# EAGLE design ovtave up pcbv1.5 (EAGLE 9.5.2)
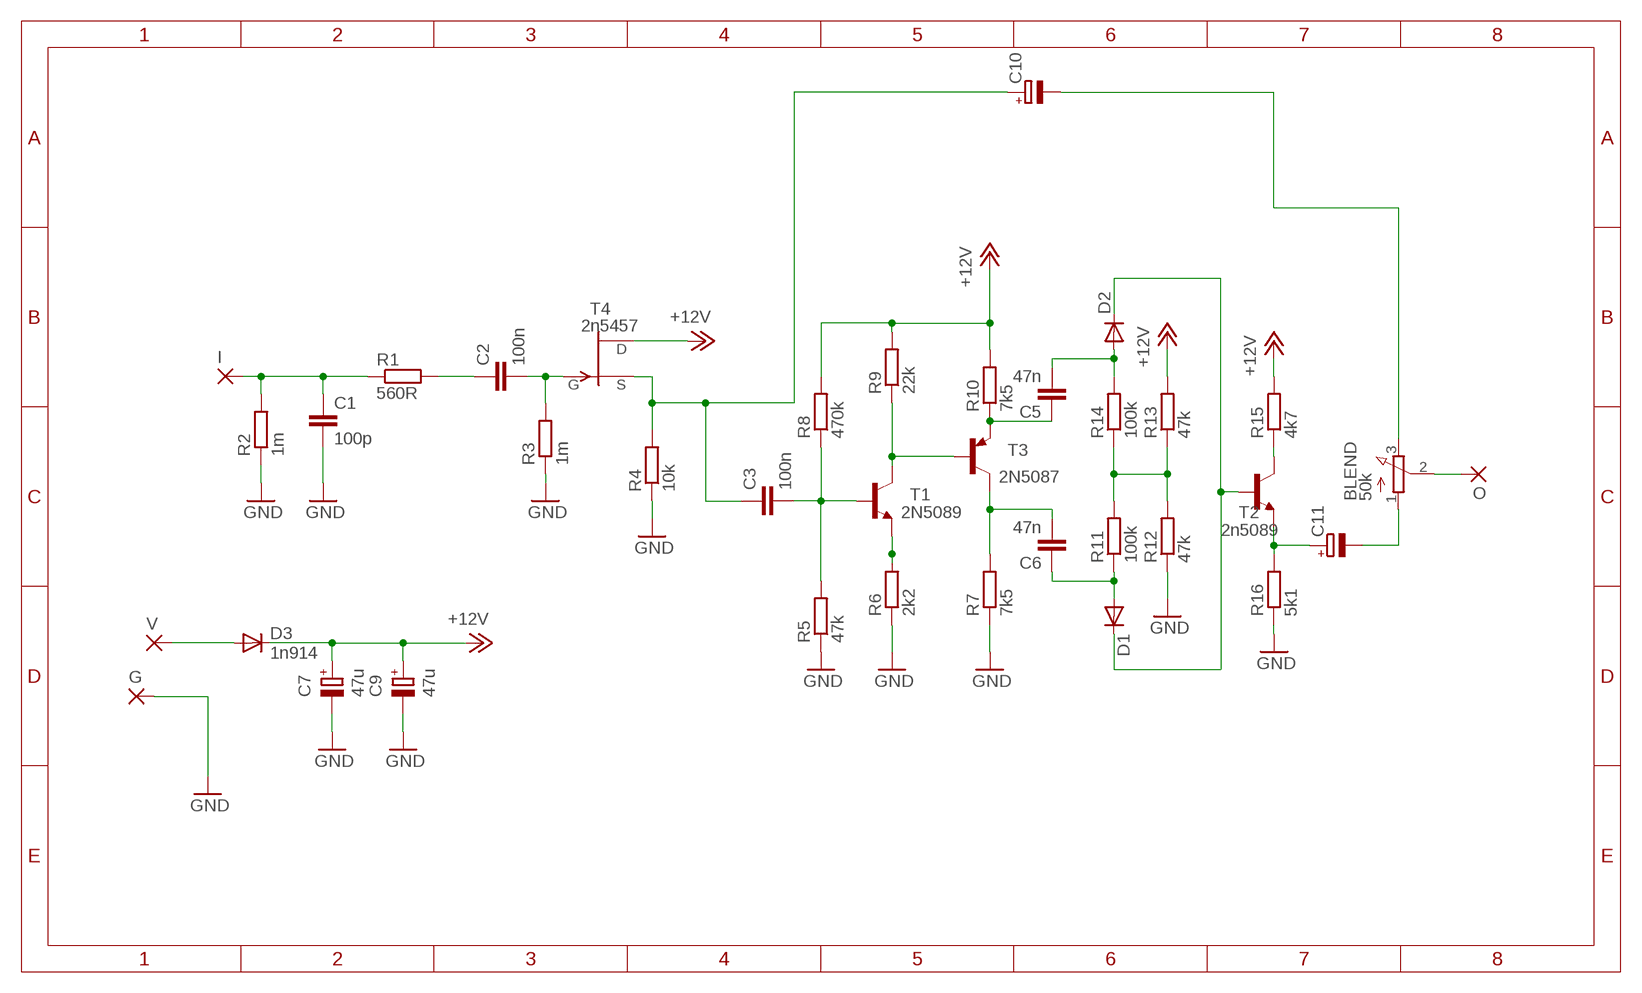
[diagram p0: schematic, sheet 1]

## Parts
BLEND  50k  HEXPOT1  [3RP/1610N]
C1  100p  C5/2.5  [C5B2.5]
C2  100n  C5/2.5  [C5B2.5]
C3  100n  C5/2.5  [C5B2.5]
C5  47n  C5/2.5  [C5B2.5]
C6  47n  C5/2.5  [C5B2.5]
C7  47u  CPOL-EUE2-4  [E2-4]
C9  47u  CPOL-EUE2-4  [E2-4]
C10  CPOL-EUE2-4  [E2-4]
C11  CPOL-EUE2-4  [E2-4]
D1  Ge fV match  SMALL_DIODEDO35-7  [DO35-7]
D2  Ge fV match  SMALL_DIODEDO35-7  [DO35-7]
D3  1n914  SMALL_DIODEDO35-7  [DO35-7]
G  1,6/0,9  [1,6/0,9]
I  1,6/0,9  [1,6/0,9]
O  1,6/0,9  [1,6/0,9]
R1  560R  R-EU_0207/7  [0207/7]
R2  1m  R-EU_0207/7  [0207/7]
R3  1m  R-EU_0207/7  [0207/7]
R4  10k  R-EU_0207/7  [0207/7]
R5  47k  R-EU_0207/7  [0207/7]
R6  2k2  R-EU_0207/7  [0207/7]
R7  7k5  R-EU_0207/7  [0207/7]
R8  470k  R-EU_0207/7  [0207/7]
R9  22k  R-EU_0207/7  [0207/7]
R10  7k5  R-EU_0207/7  [0207/7]
R11  100k  R-EU_0207/7  [0207/7]
R12  47k  R-EU_0207/7  [0207/7]
R13  47k  R-EU_0207/7  [0207/7]
R14  100k  R-EU_0207/7  [0207/7]
R15  4k7  R-EU_0207/7  [0207/7]
R16  5k1  R-EU_0207/7  [0207/7]
T1  2N5089  [TO92]
T2  2n5089  2N5089  [TO92]
T3  2N5087  [TO92]
T4  2n5457  J201  [TO92]
V  1,6/0,9  [1,6/0,9]

## Nets
+12V: C7.+ C9.+ D3.C R8.2 R9.2 R10.2 R13.2 R15.2 T4.3(D)
GND: C1.2 C7.- C9.- G.1(P) R2.1 R3.1 R4.1 R5.1 R6.1 R7.1 R12.1 R16.1
N$1: C1.1 I.1(P) R1.1 R2.2
N$2: C2.2 R3.2 T4.1(G)
N$3: C2.1 R1.2
N$4: BLEND.3(E) C10.-
N$6: R9.1 T1.1(C) T3.2(B)
N$7: R6.2 T1.3(E)
N$8: BLEND.1(A) C11.-
N$9: C3.2 R5.2 R8.1 T1.2(B)
N$10: R15.1 T2.1(C)
N$11: C6.2 R7.2 T3.1(C)
N$13: R11.2 R12.2 R13.1 R14.1
N$14: C3.1 C10.+ R4.2 T4.2(S)
N$15: C6.1 D1.A R11.1
N$16: D3.A V.1(P)
N$17: D1.C D2.C T2.2(B)
N$18: C5.2 D2.A R14.2
N$19: C11.+ R16.2 T2.3(E)
N$21: BLEND.2(S) O.1(P)
N$24: C5.1 R10.1 T3.3(E)

## Library data of the parts
BLEND = hexpedalpot:HEXPOT1: 16mm Potentiometer one level Source: http://www.alphapotentiometers.net/html/16mm_pot_2.html
C1-C3 C5 C6 = hexcapacitor-wima:C: CAPACITOR naming: grid - package width
C7 C9 = rcl:CPOL-EU: POLARIZED CAPACITOR, European symbol; SPICEPREFIX: C
C10 C11 = hexresistor:CPOL-EU: POLARIZED CAPACITOR, European symbol; SPICEPREFIX: C
D1-D3 = MusicThingModular:SMALL_DIODE: Small Signal Diode
G I O V = wirepad:1,6/0,9: THROUGH-HOLE PAD
R1-R16 = hexresistor:R-EU_: RESISTOR, European symbol; SPICEPREFIX: R
T1 T2 = transistor:2N5089: NPN TRANSISTOR
T3 = transistor-pnp:2N5087: PNP Transistor
T4 = transistor-fet:?20*: TEMIC / Siliconix N-Channel JFET Source: JFET-J201_Siliconix_data.pdf

## Net classes
0 default: width 0.203 mm

## Board
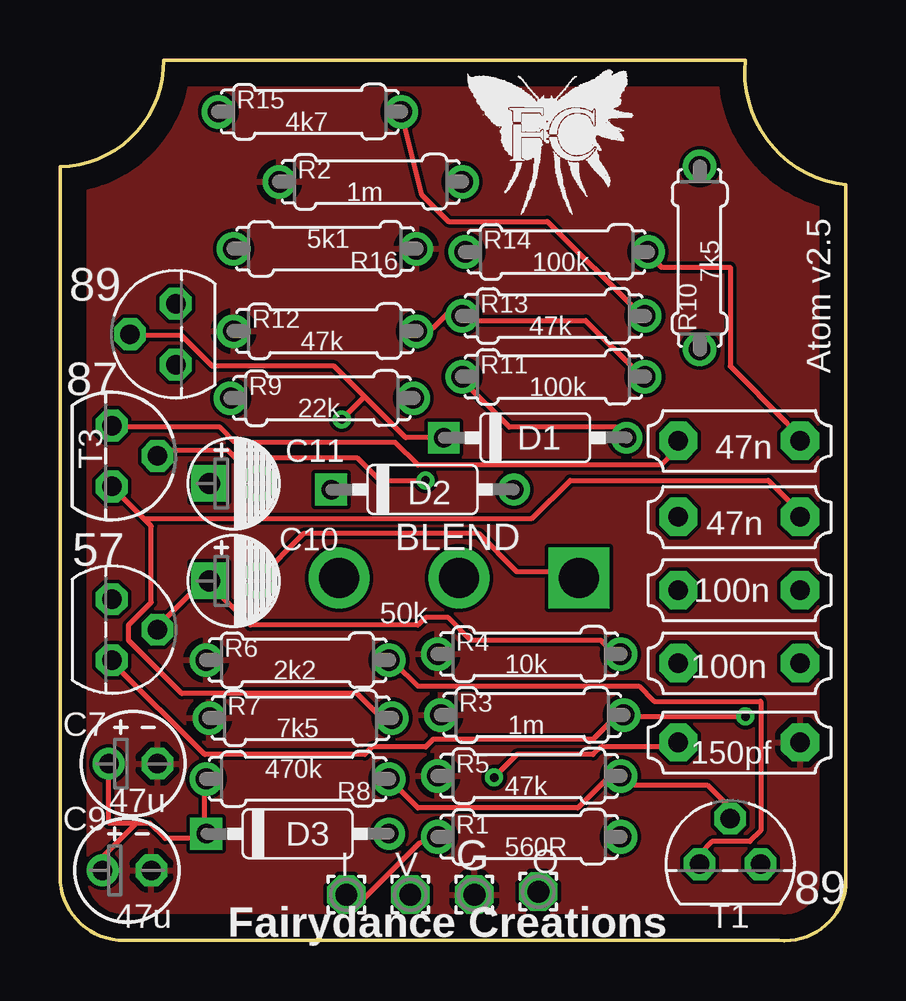
[diagram p1: board, top side]
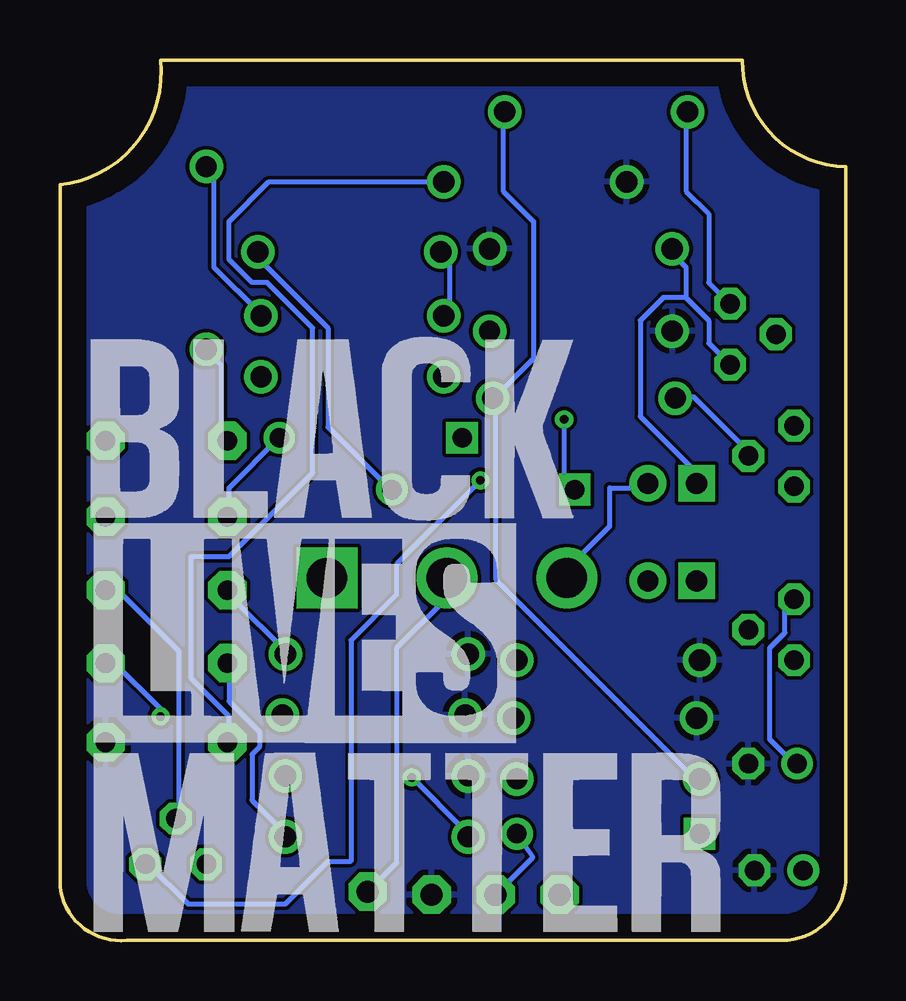
[diagram p2: board, bottom side, seen from below]

Size 32.77 x 36.72 mm. Coordinates in mm from the lower left corner, seen from the top.
Outline: 0,2.68 0,32.27 arc90 4.32,36.72 28.57,36.72 arc90 32.77,31.51 32.77,2.3 arc-90 29.97,0.01 2.67,0.01 arc-90 0,2.68
Copper layers (1*16): Top 0.035mm / dielectric 1.5mm / Bottom 0.035mm
Design rules "default": minimum track width 6mil, minimum drill 0.35mm, track to track 6mil, track to pad 6mil, pad to pad 6mil, via to via 6mil, smd to smd 6mil, copper to edge 40mil, drill to drill 6mil, minimum pad ring 10mil, minimum via ring 8mil, stop-mask expansion 4mil, vias tented up to drill 0mil, thermal gap 10mil

### Footprints (pad centres in the part's own frame; a part is rotated, then mirrored left to right if it is on the bottom)
3RP/1610N = drill 1.676 pad 2.54: 1 -5,0; 2 0,0 | drill 1.676 pad 2.54 square: 3 5,0
C5B2.5 = drill 0.813 pad 1.6 octagon: 1 -2.54,0; 2 2.54,0
E2-4 = drill 0.813 pad 1.27: + -1.016,0 | drill 0.813 pad 1.27 octagon: - 1.016,0
E2-4' = drill 0.889 pad 1.524 square: + -1.016,0 | drill 0.889 pad 1.524: - 1.016,0
DO35-7 = drill 0.813: A 3.81,0 | drill 0.813 square: C -3.81,0
1,6/0,9 = drill 0.914 pad 1.6 octagon: 1 0,0
0207/7 = drill 0.889: 1 -3.81,0; 2 3.81,0
TO92 = drill 0.813 octagon: 1 1.27,0; 2 0,1.905; 3 -1.27,0

### Placement (x,y rotation side)
BLEND  16.64,15.13 0 top
C1  28.32,8.27 0 top
C2  28.32,11.57 0 top
C3  28.32,14.62 0 top
C5  28.32,20.84 0 top
C6  28.32,17.67 0 top
C7  3.05,7.38 0 top
C9  2.79,2.93 0 top
C10  [E2-4']  7.24,15 0 top
C11  [E2-4']  7.24,19.06 0 top
D1  19.81,20.97 0 top
D2  15.11,18.81 0 top
D3  9.91,4.46 0 top
G  17.27,1.92 0 top
I  11.94,1.92 0 top
O  19.94,2.04 0 top
R1  19.56,4.33 0 top
R2  12.95,31.64 0 top
R3  19.68,9.41 0 top
R4  19.56,11.95 0 top
R5  19.56,6.87 0 top
R6  9.91,11.7 0 top
R7  10.03,9.28 0 top
R8  9.91,6.74 180 top
R9  10.92,22.62 0 top
R10  26.67,28.46 90 top
R11  20.57,23.51 0 top
R12  11.05,25.41 0 top
R13  20.57,26.05 0 top
R14  20.7,28.71 0 top
R15  10.41,34.56 0 top
R16  11.05,28.84 180 top
T1  27.94,3.19 0 top
T2  4.83,25.29 90 top
T3  2.16,20.21 270 top
T4  2.16,12.97 270 top
U$1  [BLACK-SILK-MD]  31.5,17.54 0 bottom
U$2  [LIVES-SILK-MD]  31.37,8.27 0 bottom
U$3  [MATTER-SILK-MD]  31.37,0.39 0 bottom
V  14.61,1.92 0 top

### Tracks (layer width: path | path; a pad name or v marks a point on that pad's centre or on a via)
+12V
  Top 0.203: 3.18,4.9 1.78,3.5 C9.+ | 3.18,4.9 3.75,4.9 4.38,4.27 5.97,4.27 D3.C 6.03,4.52 6.03,6.49 R8.2 | C7.+ 2.03,4.9 3.18,4.9 | R13.2 24.13,26.17 20.32,29.98 16.19,29.98 15.09,31.09 R15.2
  Bottom 0.203: R13.2 24.45,26.17 26.35,28.08 26.35,32.27 R10.2 | R15.2 14.29,34.49 14.29,31.25 13.02,29.98 13.02,24.27 14.61,22.68 R9.2 14.61,22.36 14.61,15.06 6.35,6.81 R8.2 | T4.3 2.54,14.11 2.54,12.84 3.18,12.2 3.18,8.39 2.54,7.76 C7.+
GND
  pour Bottom: -2.03,37.1 -2.03,3.06 arc90 1.65,-0.62 36.45,-0.62 36.45,37.1
  pour Top: 28.74,39.75 35.69,28.94 35.69,0.14 35.31,-0.24 15.11,-0.24 14.86,0.01 2.16,0.01 -1.78,3.95 -1.78,36.11
N$1  (via drill 0.35)
  Top 0.203: R1.1 14.99,4.08 12.64,1.73 12.32,1.73 I.1 | v18.1,6.81 19.05,7.76 22.23,7.76 22.54,8.08 25.72,8.08 C1.1
  Bottom 0.203: R2.2 24.07,31.64 25.72,29.98 25.72,28.4 24.77,27.44 24.13,27.44 22.23,25.54 22.23,19.51 25.72,16.01 27.31,16.01 27.31,10.93 25.72,9.35 25.72,8.39 C1.1 | v18.1,6.81 15.88,4.58 R1.1
N$2  (via drill 0.35)
  Top 0.203: 23.5,9.35 23.18,9.35 22.23,8.39 15.56,8.39 15.24,8.08 13.02,8.08 12.7,7.76 6.03,7.76 2.22,11.57 T4.1 | 23.5,9.35 v28.57,9.35 | 23.5,9.35 R3.2
  Bottom 0.203: v28.57,9.35 28.57,9.66 30.48,11.57 C2.2
N$3
  Bottom 0.203: R1.2 23.5,4.58 24.77,5.85 24.77,7.76 24.45,8.08 24.45,8.71 25.72,9.98 25.72,11.57 C2.1
N$4
  Top 0.203: C10.- 8.26,15.06 10.16,16.97 17.46,16.97 19.05,15.38 21.59,15.38 BLEND.3
N$6  (via drill 0.35)
  Top 0.203: v15.24,19.19 13.34,19.19 12.38,20.14 7.3,20.14 6.98,20.46 4.13,20.46 T3.2
  Bottom 0.203: T3.2 4.13,20.46 6.35,22.68 6.98,22.68 R9.1 | v15.24,19.19 18.73,15.7 18.73,14.43 20.64,12.52 20.64,3.31 21.59,3.31 23.37,1.54 27.43,1.54 29.08,3.19 T1.1
N$7
  Top 0.203: T1.3 26.67,3.63 27.18,4.14 28.76,4.14 29.21,4.58 29.21,9.98 24.77,9.98 24.13,10.62 14.92,10.62 13.97,11.57 R6.2
N$8
  Bottom 0.203: C11.- 8.51,18.87 9.84,18.87 9.84,17.28 11.43,15.7 11.43,15.38 BLEND.1
N$9
  Top 0.203: T1.2 27.94,5.54 26.99,6.49 23.81,6.49 23.5,6.81 R5.2 23.18,6.81 22.86,6.81 21.59,5.54 14.92,5.54 R8.1
  Bottom 0.203: T1.2 27.81,5.22 27.81,12.08 30.35,14.62 C3.2
N$10
  Bottom 0.203: T2.1 5.71,27.44 5.71,30.3 6.67,31.25 6.67,34.49 R15.1
N$11
  Top 0.203: 3.49,17.6 3.81,17.28 3.81,14.11 2.86,13.16 2.86,12.52 5.08,10.3 12.38,10.3 13.34,9.35 13.65,9.35 R7.2 | 3.49,17.6 T3.1 | 3.49,17.6 19.68,17.6 21.27,19.19 29.53,19.19 30.8,17.92 C6.2
N$13
  Top 0.203: R12.2 14.95,25.54 15.56,25.54 16.19,26.17 16.51,26.17 R13.1 16.83,25.86 21.91,25.86 24.13,23.63 R11.2
  Bottom 0.203: R14.1 16.83,28.71 16.51,28.4 16.51,26.17 R13.1
N$14
  Top 0.203: T4.2 4.13,13.16 5.71,14.74 6.03,14.74 C10.+ 6.35,14.74 7.94,13.16 14.92,13.16 15.24,13.47 16.19,13.47 17.14,12.52 22.54,12.52 22.86,12.2 23.18,12.2 R4.2
  Bottom 0.203: R4.2 23.5,12.2 25.4,14.11 25.4,14.62 C3.1
N$15
  Top 0.203: D1.A 23.18,21.41 18.73,21.41 16.83,23.32 R11.1
  Bottom 0.203: D1.A 25.72,18.87 25.72,17.92 C6.1
N$16
  Bottom 0.203: D3.A 13.06,3.47 V.1
N$17  (via drill 0.35)
  Top 0.203: 12.7,22.68 14.41,20.97 D1.C | 12.7,22.68 11.43,23.95 6.35,23.95 5.08,25.22 3.18,25.22 T2.2 | 12.7,22.68 v11.75,21.73
  Bottom 0.203: v11.75,21.73 11.75,19.19 11.43,18.87 D2.C
N$18
  Top 0.203: C5.2 30.29,21.6 27.94,23.95 27.94,28.08 25.08,28.08 24.45,28.71 R14.2
  Bottom 0.203: D2.A 19.05,18.87 21.59,21.41 21.59,25.54 24.45,28.4 24.45,28.71 R14.2
N$19
  Bottom 0.203: T2.3 5.71,24.9 5.71,25.86 6.67,26.81 | 6.67,26.81 6.67,28.08 7.24,28.65 R16.2 | C11.+ 6.22,19.51 8.57,21.86 8.57,25.86 7.62,26.81 6.67,26.81
N$21
  Bottom 0.203: O.1 18.73,3.25 18.73,12.2 16.83,14.11 16.83,15.06 BLEND.2
N$24
  Top 0.203: T3.3 2.22,21.41 6.67,21.41 7.3,20.78 13.97,20.78 14.92,19.82 25.08,19.82 25.99,20.73 C5.1
  Bottom 0.203: R10.1 26.67,24.59 26.04,23.95 26.04,21.35 C5.1

### Text on the board
tNames: Atom v2.5 | 89 | 87 | 47n | 47n | 57 | 100n | 100n | 150pf | 89 | Fairydance Creations